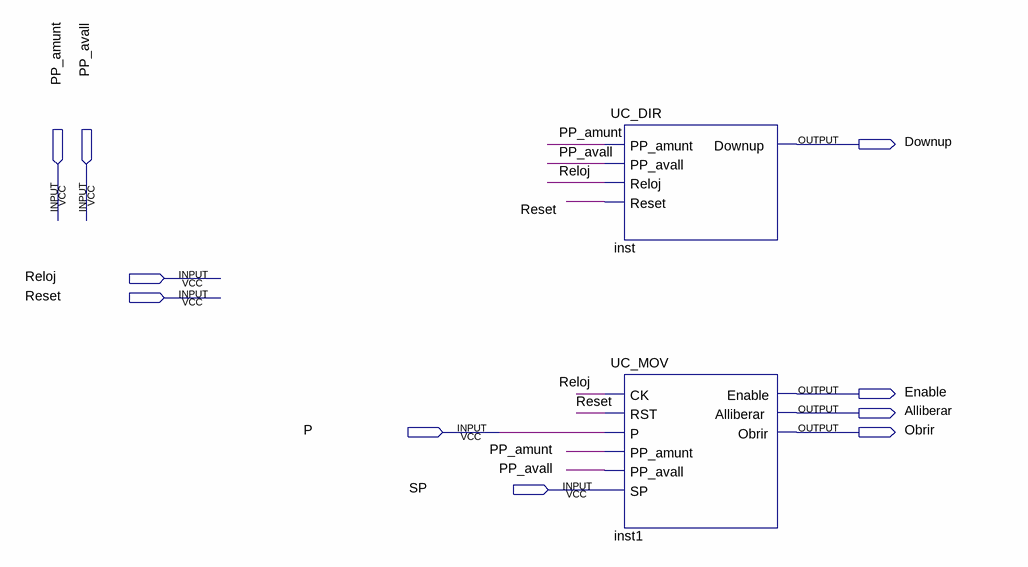
[diagram p0: schematic sheet]
// Quartus schematic UC.bdf as structural Verilog: 2 symbols, 10 pins
module UC (
  input  PP_amunt,
  input  PP_avall,
  input  Reloj,
  input  Reset,
  input  P,
  input  SP,
  output Downup,
  output Enable,
  output Alliberar,
  output Obrir
);

  UC_DIR inst (.PP_amunt(PP_amunt), .PP_avall(PP_avall), .Reloj(Reloj), .Reset(Reset), .Downup(Downup));
  UC_MOV inst1 (
    .CK(Reloj), .RST(Reset), .P(P), .PP_amunt(PP_amunt), .PP_avall(PP_avall), .SP(SP), .Enable(Enable),
    .Alliberar(Alliberar), .Obrir(Obrir));
endmodule
